# EAGLE design ClipBoard-V1.1 (EAGLE 9.2.0)
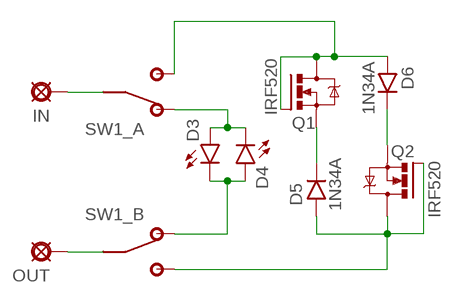
[diagram p0: schematic, sheet 1]

## Parts
D3  RED  LED3MM  [LED3MM]
D4  RED  LED3MM  [LED3MM]
D5  1N34A  DO07  [DO07]
D6  1N34A  DO07  [DO07]
IN  CLIPIN  PAD  [SQUARE]
OUT  CLIPOUT  PAD  [SQUARE]
Q1  IRF520  [TO220BV]
Q2  IRF520  [TO220BV]
SW1  DPDT  DPDTDPDT_2  [DPDT_PCB]

## Nets
N$1: D3.K(C) D4.A SW1.B2
N$2: D5.C Q1.S
N$3: OUT.1(PAD) SW1.B1
N$4: D6.C Q2.S
N$5: D6.A Q1.D Q1.G SW1.A3
N$6: IN.1(PAD) SW1.A1
N$7: D3.A D4.K(C) SW1.A2
N$8: D5.A Q2.D Q2.G SW1.B3

## Library data of the parts
D3 D4 = mb_diodes:LED
D5 D6 = mb_diodes:DO07: DO-07 Package for 1N34A and similar Ge diodes
IN OUT = mb_supply:PAD: PAD use this package for pads with any purpose, including input, output, send or return various pad shapes: round, square, octogonal, long, and long offset
Q1 Q2 = transistor-power:IRF520: HEXFET Power MOSFET
SW1 = mb_switches:DPDT

## Board
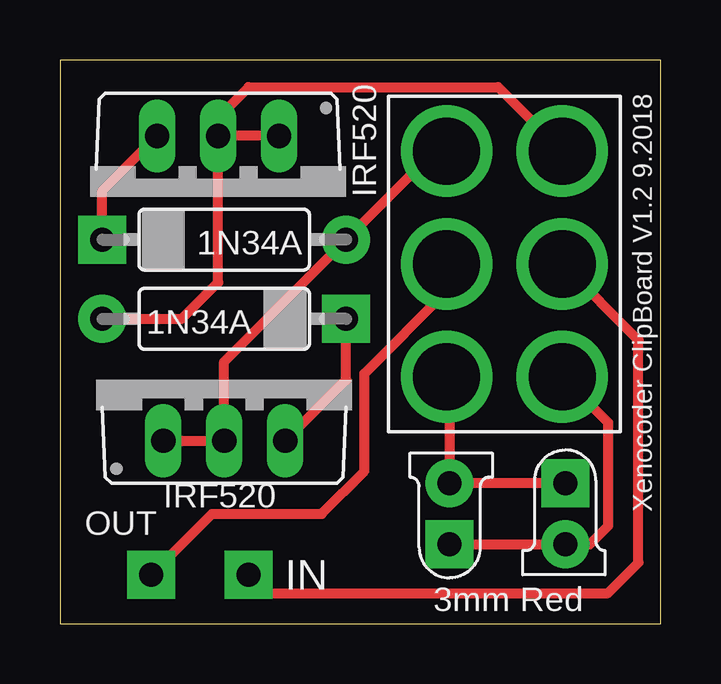
[diagram p1: board, top side]
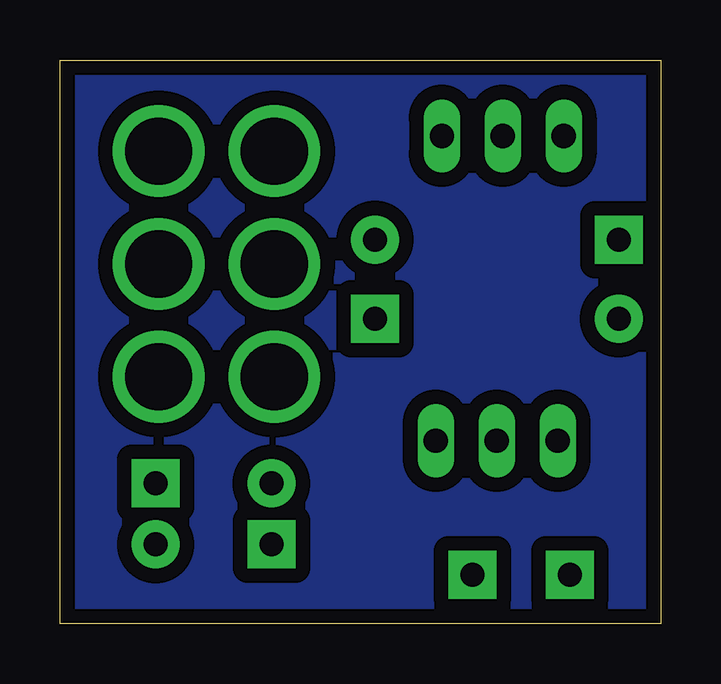
[diagram p2: board, bottom side, seen from below]

Size 25.06 x 23.48 mm. Coordinates in mm from the lower left corner, seen from the top.
Outline: 25.06,0 25.06,23.48 0,23.48 0,0 25.06,0
Copper layers (1*16): Top 0.0356mm / dielectric 1.5011mm / Bottom 0.0356mm
Design rules "LaenPCBOrder": minimum track width 6mil, minimum drill 13mil, track to track 6mil, track to pad 6mil, pad to pad 6mil, via to via 6mil, smd to smd 6mil, copper to edge 15mil, drill to drill 6mil, minimum pad ring 7mil, minimum via ring 7mil, stop-mask expansion 3mil, vias tented up to drill 0mil, thermal gap 10mil

### Footprints (pad centres in the part's own frame; a part is rotated, then mirrored left to right if it is on the bottom)
LED3MM = drill 1 pad 2 square: A -1.27,0 | drill 1 pad 2: K 1.27,0
DO07 = drill 1 pad 2: A 5.08,0 | drill 1 pad 2 square: C -5.08,0
SQUARE = drill 1 pad 2 square: 1 0,0
TO220BV = drill 1.016 long: D 0,-2.54; G -2.54,-2.54; S 2.54,-2.54
DPDT_PCB = drill 2.8 pad 3.81: A1 -2.413,0; A2 -2.413,4.699; A3 -2.413,-4.699; B1 2.413,0; B2 2.413,4.699; B3 2.413,-4.699

### Placement (x,y rotation side)
D3  16.25,4.57 90 top
D4  21.07,4.57 270 top
D5  6.85,16 0 top
D6  6.85,12.7 180 top
IN  7.86,2.03 90 top
OUT  3.8,2.03 90 top
Q1  6.59,17.78 180 top
Q2  6.85,10.16 0 top
SW1  18.53,14.99 180 top

### Tracks (layer width: path | path; a pad name or v marks a point on that pad's centre or on a via)
GND
  pour Bottom (isolate 0.61): -0.01,0 -0.01,23.48 25.06,23.48 25.06,0
N$1
  Top 0.406: D4.A D3.K 16.25,10.16 SW1.B2
N$2
  Top 0.406: D5.C 1.77,18.03 Q1.S
N$3
  Top 0.406: OUT.1 6.34,4.57 10.91,4.57 12.69,6.35 12.69,10.41 16.12,13.84 SW1.B1
N$4
  Top 0.406: Q2.S 11.93,10.16 D6.C
N$5
  Top 0.406: Q1.D 6.59,21.08 7.86,22.35 18.28,22.35 SW1.A3 | D6.A 5.07,12.7 6.59,14.22 Q1.D | Q1.G Q1.D
N$6
  Top 0.406: IN.1 8.63,1.27 22.85,1.27 24.12,2.54 24.12,11.81 SW1.A1
N$7
  Top 0.406: D3.A 20.82,3.3 | 20.82,3.3 D4.K | SW1.A2 22.85,8.38 22.85,4.06 22.09,3.3 20.82,3.3
N$8
  Top 0.406: SW1.B3 15.61,19.68 D5.A 6.85,10.92 Q2.D Q2.G

### Text on the board
tNames: Xenocoder ClipBoard V1.2 9.2018 | 3mm Red